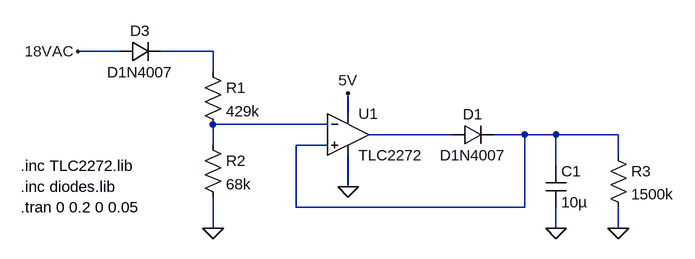
[diagram p0: schematic draft3.asc]
draft3.asc, the LTspice schematic file:
Version 4
SHEET 1 1460 680
WIRE -592 96 -656 96
WIRE -448 96 -528 96
WIRE -448 128 -448 96
WIRE -240 192 -240 160
WIRE -272 208 -448 208
WIRE -80 224 -208 224
WIRE 32 224 -16 224
WIRE 80 224 32 224
WIRE 176 224 80 224
WIRE -448 240 -448 208
WIRE -272 240 -320 240
WIRE 176 256 176 224
WIRE 80 272 80 224
WIRE -240 304 -240 256
WIRE -320 336 -320 240
WIRE 32 336 32 224
WIRE 32 336 -320 336
WIRE -448 368 -448 320
WIRE 80 368 80 336
WIRE 176 368 176 336
FLAG -448 368 0
FLAG 80 368 0
FLAG 176 368 0
FLAG -240 304 0
FLAG -240 160 5V
FLAG -656 96 18VAC
SYMBOL res -464 224 R0
SYMATTR InstName R2
SYMATTR Value 68k
SYMBOL res -464 112 R0
SYMATTR InstName R1
SYMATTR Value 429k
SYMBOL cap 64 272 R0
SYMATTR InstName C1
SYMATTR Value 10µ
SYMBOL diode -592 112 R270
WINDOW 0 32 32 VTop 2
WINDOW 3 0 32 VBottom 2
SYMATTR InstName D3
SYMATTR Value D1N4007
SYMBOL diode -80 240 R270
WINDOW 0 32 32 VTop 2
WINDOW 3 0 32 VBottom 2
SYMATTR InstName D1
SYMATTR Value D1N4007
SYMBOL res 160 240 R0
SYMATTR InstName R3
SYMATTR Value 1500k
SYMBOL Opamps\\opamp2 -240 160 R0
SYMATTR InstName U1
SYMATTR Value TLC2272
TEXT -744 336 Left 2 !.tran 0 0.2 0 0.05
TEXT -744 304 Left 2 !.inc diodes.lib
TEXT -744 272 Left 2 !.inc TLC2272.lib

The netlist it stands for:
* draft3.asc
R2 N002 0 68k
R1 N001 N002 429k
C1 N004 0 10µ
D3 18VAC N001 D1N4007
D1 N003 N004 D1N4007
R3 N004 0 1500k
XU1 N004 N002 5V 0 N003 TLC2272  ; pins In+ In- V+ V- OUT
.model D D
.lib standard.dio
.tran 0 0.2 0 0.05
.inc diodes.lib
.inc TLC2272.lib
.backanno
.end